# Altium schematic sheet DaughterBoardInterface.SchDoc: JESD204B
size A4 portrait; Author: Carlos Barreiro; DocumentNumber: 7; SheetNumber: 7; SheetTotal: 16; Organization: Escuela Técnica Superior de Ingeniería de Sistemas Informáticos de la Universidad Politécnica de Madrid; Address1: Campus Sur de la Universidad Politécnica de Madrid; Address2: Calle de Alan Turing, s/nº; Address3: Madrid 28031; Address4: España
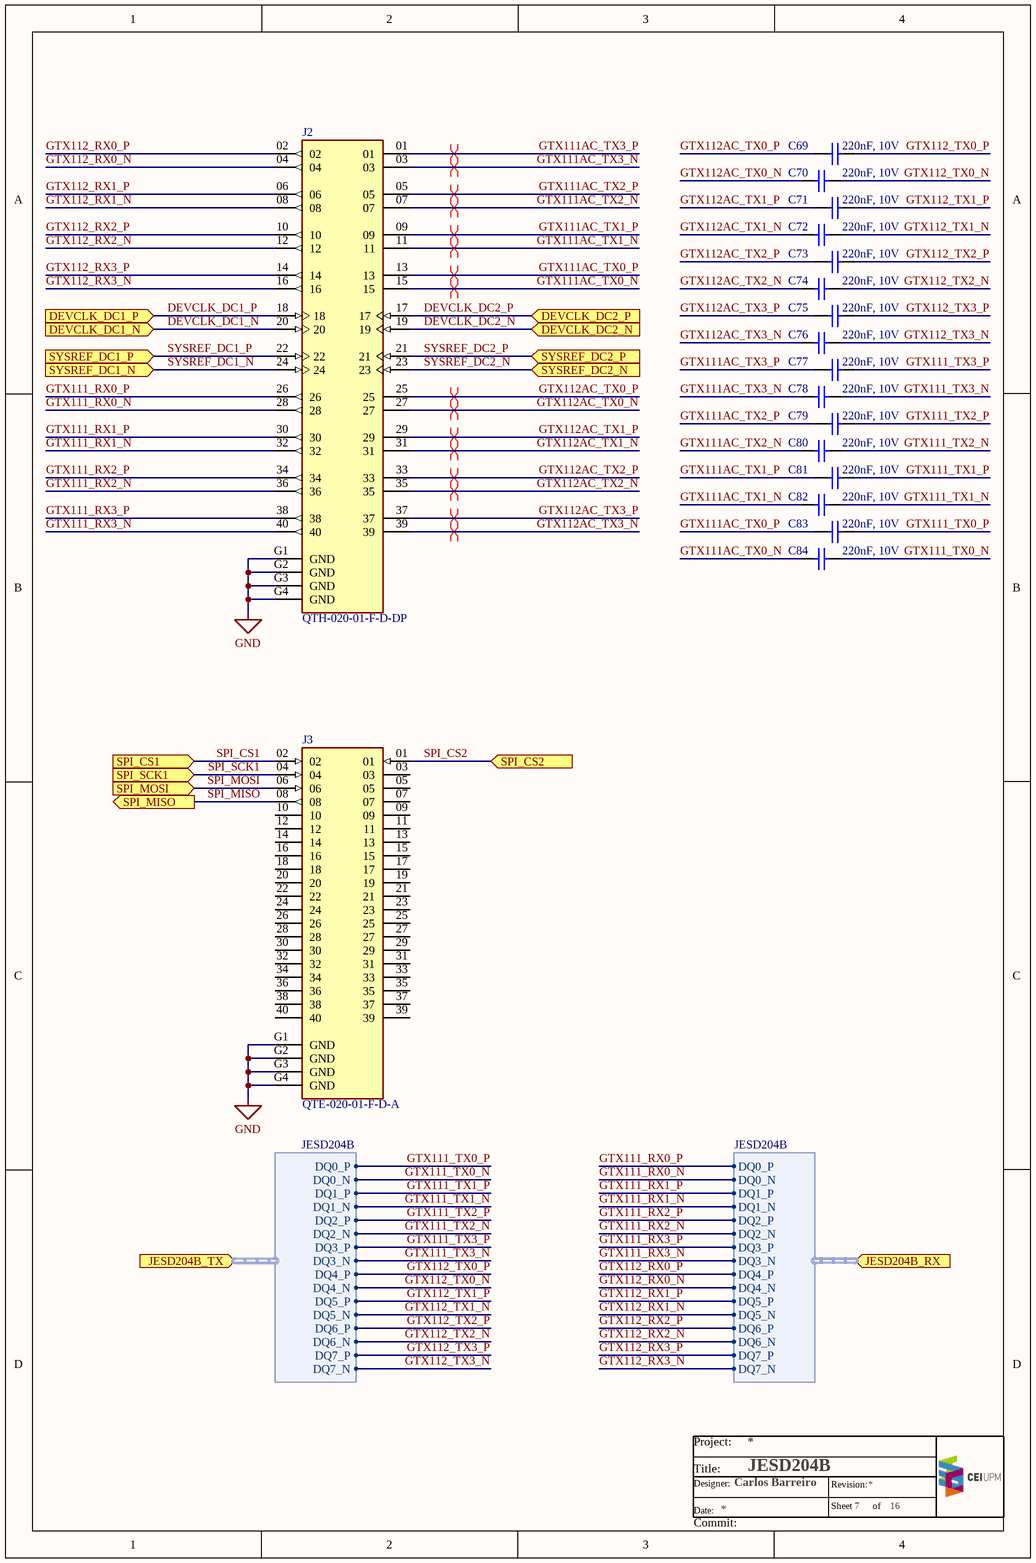
[diagram p0: DaughterBoardInterface.SchDoc]

## Parts
C69  220nF, 10V  [WURTH_WCAP-CSGP_0402]
C70  220nF, 10V  [WURTH_WCAP-CSGP_0402]
C71  220nF, 10V  [WURTH_WCAP-CSGP_0402]
C72  220nF, 10V  [WURTH_WCAP-CSGP_0402]
C73  220nF, 10V  [WURTH_WCAP-CSGP_0402]
C74  220nF, 10V  [WURTH_WCAP-CSGP_0402]
C75  220nF, 10V  [WURTH_WCAP-CSGP_0402]
C76  220nF, 10V  [WURTH_WCAP-CSGP_0402]
C77  220nF, 10V  [WURTH_WCAP-CSGP_0402]
C78  220nF, 10V  [WURTH_WCAP-CSGP_0402]
C79  220nF, 10V  [WURTH_WCAP-CSGP_0402]
C80  220nF, 10V  [WURTH_WCAP-CSGP_0402]
C81  220nF, 10V  [WURTH_WCAP-CSGP_0402]
C82  220nF, 10V  [WURTH_WCAP-CSGP_0402]
C83  220nF, 10V  [WURTH_WCAP-CSGP_0402]
C84  220nF, 10V  [WURTH_WCAP-CSGP_0402]
J2  QTH-020-01-F-D-DP  [SAMTEC_QTH-020-01-X-D-DP-A]
J3  QTE-020-01-F-D-A  [SAMTEC_QTE-020-01-X-D-A]

## Ports
DEVCLK_DC1_N (in), DEVCLK_DC1_P (in), DEVCLK_DC2_N (in), DEVCLK_DC2_P (in), JESD204B_RX (in, harness JESD204B), JESD204B_TX (in, harness JESD204B), SPI_CS1 (in), SPI_CS2 (in), SPI_MISO (out), SPI_MOSI (in), SPI_SCK1 (in), SYSREF_DC1_N (in), SYSREF_DC1_P (in), SYSREF_DC2_N (in), SYSREF_DC2_P (in)

## Harnesses
JESD204B: DQ0_P, DQ0_N, DQ1_P, DQ1_N, DQ2_P, DQ2_N, DQ3_P, DQ3_N, DQ4_P, DQ4_N, DQ5_P, DQ5_N, DQ6_P, DQ6_N, DQ7_P, DQ7_N

## Nets
GND: J2.G1(GND) J2.G2(GND) J2.G3(GND) J2.G4(GND) J3.G1(GND) J3.G2(GND) J3.G3(GND) J3.G4(GND)
DEVCLK_DC1_N: J2.20 ; port DEVCLK_DC1_N
DEVCLK_DC1_P: J2.18 ; port DEVCLK_DC1_P
DEVCLK_DC2_N: J2.19 ; port DEVCLK_DC2_N
DEVCLK_DC2_P: J2.17 ; port DEVCLK_DC2_P
GTX111_RX0_N: J2.28 ; port JESD204B_RX.DQ0_N
GTX111_RX0_P: J2.26 ; port JESD204B_RX.DQ0_P
GTX111_RX1_N: J2.32 ; port JESD204B_RX.DQ1_N
GTX111_RX1_P: J2.30 ; port JESD204B_RX.DQ1_P
GTX111_RX2_N: J2.36 ; port JESD204B_RX.DQ2_N
GTX111_RX2_P: J2.34 ; port JESD204B_RX.DQ2_P
GTX111_RX3_N: J2.40 ; port JESD204B_RX.DQ3_N
GTX111_RX3_P: J2.38 ; port JESD204B_RX.DQ3_P
GTX111_TX0_N: C84.2 ; port JESD204B_TX.DQ0_N
GTX111_TX0_P: C83.2 ; port JESD204B_TX.DQ0_P
GTX111_TX1_N: C82.2 ; port JESD204B_TX.DQ1_N
GTX111_TX1_P: C81.2 ; port JESD204B_TX.DQ1_P
GTX111_TX2_N: C80.2 ; port JESD204B_TX.DQ2_N
GTX111_TX2_P: C79.2 ; port JESD204B_TX.DQ2_P
GTX111_TX3_N: C78.2 ; port JESD204B_TX.DQ3_N
GTX111_TX3_P: C77.2 ; port JESD204B_TX.DQ3_P
GTX111AC_TX0_N: C84.1 J2.15
GTX111AC_TX0_P: C83.1 J2.13
GTX111AC_TX1_N: C82.1 J2.11
GTX111AC_TX1_P: C81.1 J2.09
GTX111AC_TX2_N: C80.1 J2.07
GTX111AC_TX2_P: C79.1 J2.05
GTX111AC_TX3_N: C78.1 J2.03
GTX111AC_TX3_P: C77.1 J2.01
GTX112_RX0_N: J2.04 ; port JESD204B_RX.DQ4_N
GTX112_RX0_P: J2.02 ; port JESD204B_RX.DQ4_P
GTX112_RX1_N: J2.08 ; port JESD204B_RX.DQ5_N
GTX112_RX1_P: J2.06 ; port JESD204B_RX.DQ5_P
GTX112_RX2_N: J2.12 ; port JESD204B_RX.DQ6_N
GTX112_RX2_P: J2.10 ; port JESD204B_RX.DQ6_P
GTX112_RX3_N: J2.16 ; port JESD204B_RX.DQ7_N
GTX112_RX3_P: J2.14 ; port JESD204B_RX.DQ7_P
GTX112_TX0_N: C70.2 ; port JESD204B_TX.DQ4_N
GTX112_TX0_P: C69.2 ; port JESD204B_TX.DQ4_P
GTX112_TX1_N: C72.2 ; port JESD204B_TX.DQ5_N
GTX112_TX1_P: C71.2 ; port JESD204B_TX.DQ5_P
GTX112_TX2_N: C74.2 ; port JESD204B_TX.DQ6_N
GTX112_TX2_P: C73.2 ; port JESD204B_TX.DQ6_P
GTX112_TX3_N: C76.2 ; port JESD204B_TX.DQ7_N
GTX112_TX3_P: C75.2 ; port JESD204B_TX.DQ7_P
GTX112AC_TX0_N: C70.1 J2.27
GTX112AC_TX0_P: C69.1 J2.25
GTX112AC_TX1_N: C72.1 J2.31
GTX112AC_TX1_P: C71.1 J2.29
GTX112AC_TX2_N: C74.1 J2.35
GTX112AC_TX2_P: C73.1 J2.33
GTX112AC_TX3_N: C76.1 J2.39
GTX112AC_TX3_P: C75.1 J2.37
SPI_CS1: J3.02 ; port SPI_CS1
SPI_CS2: J3.01 ; port SPI_CS2
SPI_MISO: J3.08 ; port SPI_MISO
SPI_MOSI: J3.06 ; port SPI_MOSI
SPI_SCK1: J3.04 ; port SPI_SCK1
SYSREF_DC1_N: J2.24 ; port SYSREF_DC1_N
SYSREF_DC1_P: J2.22 ; port SYSREF_DC1_P
SYSREF_DC2_N: J2.23 ; port SYSREF_DC2_N
SYSREF_DC2_P: J2.21 ; port SYSREF_DC2_P

Not connected (* = marked no-connect by the designer): J3 03 05 07 09 10 11 12 13 14 15 16 17 18 19 20 21 22 23 24 25 26 27 28 29 30 31 32 33 34 35 36 37 38 39 40

## Layout directives
differential pair: GTX111AC_TX0_N, GTX111AC_TX0_P, GTX111AC_TX1_N, GTX111AC_TX1_P, GTX111AC_TX2_N, GTX111AC_TX2_P, GTX111AC_TX3_N, GTX111AC_TX3_P, GTX112AC_TX0_N, GTX112AC_TX0_P, GTX112AC_TX1_N, GTX112AC_TX1_P, GTX112AC_TX2_N, GTX112AC_TX2_P, GTX112AC_TX3_N, GTX112AC_TX3_P

## Notes on the sheet
- Project:
- Title:
- Date:
- Designer:
- Sheet
- Revision:
- of
- Commit:

## Library data of the parts
C69-C84 = 885012105011: WCAP-CSGP Multilayer Ceramic Chip Capacitor, General Purpose, size 0402, X5R, 220nF, 10V; Manufacturer: Wurth Elektronik; Rated Voltage: 10VDC; Isolation Resistance  min.: 2.3GOhm; Capacitance Tolerance: +/-20%; Dissipation Factor max.: 5%; Technical Reference: X5R0402224M010DFCT10000; ComponentLink1Description: Manufacturer; ComponentLink1URL: http://www.we-online.de; ComponentLink2Description: Datasheet; ComponentLink2URL: https://www.we-online.com/catalog/datasheet/885012105011.pdf; Operating Temperature: -55 to +85degC; Packaging: Tape and Reel; Manufacturer Part Number: 885012105011; Published Date: April 2021; Ceramic Type: X5R; Height: 0.5mm; Mounting Technology: SMT; Size: 0402; Capacitance: 220nF; Q-Factor min.: -
J2 = QTH-020-01-F-D-DP: 0.50 mm Q Pairs® High-Speed Ground Plane Terminal Strip, Differential Pair; MF: Samtec; System: Connector; MP: QTH-020-01-F-D-DP; Supplier 1: Digi-Key; Supplier 2: Mouser; Supplier Part Number 1: QTH-020-01-F-D-DP-ND; Supplier Part Number 2: 200-QTH02001FDDP; ComponentLink1Description: MF; ComponentLink1URL: https://www.samtec.com/products/qth-dp
J3 = QTE-020-01-F-D-A: 40 Position Connector Header, Outer Shroud Contacts Surface Mount Gold; MF: Samtec; MP: QTE-020-01-F-D-A; Supplier 1: Digi-Key; Supplier 2: Mouser; Supplier Part Number 1: SAM8846-ND; Supplier Part Number 2: 200-QTE02001FDA; System: Connector